# Altium schematic sheet schematic.SchDoc
size A4; SheetNumber: 1; SheetTotal: 3
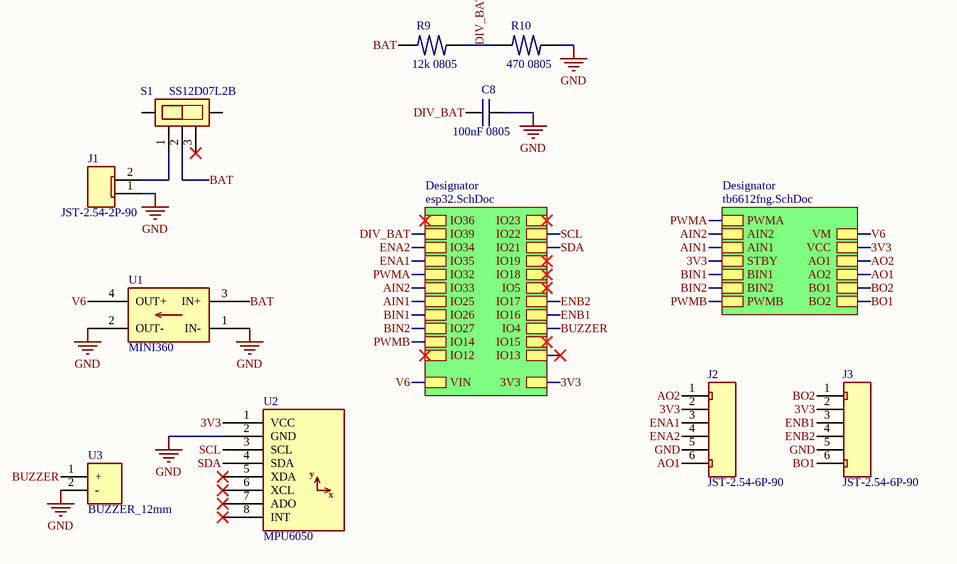
[diagram p0: schematic.SchDoc]

## Parts
C8  100nF 0805  [CAPACITOR 0805]
J1  JST-2.54-2P-90  [JST-2.54-2P-90]
J2  JST-2.54-6P-90  [JST-2.54-6P-90]
J3  JST-2.54-6P-90  [JST-2.54-6P-90]
R9  12k 0805  [RESISTOR_0805]
R10  470 0805  [RESISTOR_0805]
S1  SS12D07L2B  [SS12D07L2B]
U1  MINI360  [MINI360]
U2  MPU6050  [MPU6050]
U3  BUZZER_12mm  [BUZZER_12mm]

## Sub-sheets
Designator = esp32.SchDoc: IO23, IO22, IO21, IO19, IO18, IO5, IO17, IO16, IO4, IO15, IO13, IO12, IO14, IO27, IO26, IO25, IO33, IO32, IO35, IO34, IO39, IO36, 3V3, VIN
Designator = tb6612fng.SchDoc: AIN1, BIN1, BIN2, AIN2, STBY, PWMA, PWMB, AO1, AO2, BO1, VM, VCC, BO2

## Nets
GND: C8.2 J1.1 J2.5 J3.5 R10.1 U1.1(IN-) U1.2(OUT-) U2.2(GND) U3.2(-)
3V3: J2.2 J3.2 U2.1(VCC) ; sheet Designator/3V3, sheet Designator/STBY, sheet Designator/VCC
AIN1: sheet Designator/IO25, sheet Designator/AIN1
AIN2: sheet Designator/IO33, sheet Designator/AIN2
AO1: J2.6 ; sheet Designator/AO2
AO2: J2.1 ; sheet Designator/AO1
BAT: R9.2 S1.2 U1.3(IN+)
BIN1: sheet Designator/IO26, sheet Designator/BIN1
BIN2: sheet Designator/IO27, sheet Designator/BIN2
BO1: J3.6 ; sheet Designator/BO2
BO2: J3.1 ; sheet Designator/BO1
BUZZER: U3.1(+) ; sheet Designator/IO4
DIV_BAT: C8.1 R9.1 R10.2 ; sheet Designator/IO39
ENA1: J2.3 ; sheet Designator/IO35
ENA2: J2.4 ; sheet Designator/IO34
ENB1: J3.3 ; sheet Designator/IO16
ENB2: J3.4 ; sheet Designator/IO17
PWMA: sheet Designator/IO32, sheet Designator/PWMA
PWMB: sheet Designator/IO14, sheet Designator/PWMB
SCL: U2.3(SCL) ; sheet Designator/IO22
SDA: U2.4(SDA) ; sheet Designator/IO21
V6: U1.4(OUT+) ; sheet Designator/VIN, sheet Designator/VM
NetJ1_2: J1.2 S1.1

Not connected (* = marked no-connect by the designer): S1 3*; U2 5(XDA)* 6(XCL)* 7(ADO)* 8(INT)*

## Notes on the sheet
- (in symbol MPU6050) y; x

## Library data of the parts
C8 = CAPACITOR 0805: Generic Capacitor 0805, 2x1.25x1.4mm.
J1 = JST-2.54-2P-90: Female Connector JST 2 Vias, 2.54mm 90º.
J2 J3 = JST-2.54-6P-90: Female Connector JST 6 Vias, 2.54mm 90º.
R9 R10 = RESISTOR_0805
S1 = SS12D07L2B: Vertical Slide Switch 5 Pins 8.7x4.5x4.7mm.; JLCPCB PN: C480342
U1 = MINI360: MODULE BUCK STEP DOWN 3A 18x12mm; ComponentLink1Description: Datasheet; ComponentLink1URL: https://cdn-shop.adafruit.com/datasheets/MP2307_r1.9.pdf
U2 = MPU6050: IMU ACCEL/GYRO 3-AXIS I2C; ComponentLink1Description: Datasheet; ComponentLink1URL: https://invensense.tdk.com/wp-content/uploads/2015/02/MPU-6000-Datasheet1.pdf
U3 = BUZZER_12mm: BUZZER MAGNETIC 12MM; Digikey PN: 433-WT-1209T-ND; Mouser PN: 433-WT-1209T-ND